# EasyEDA Pro project 2.8_pcb_src.eprj, schematic Schematic2
Board Name: Board2; Create Date: 2025-01-27; Page Name: P1; Project Name: 2.8_pcb_src; Schematic Name: Schematic2; Update Date: 2025-02-17; Company: EasyEDA.com; Page Size: A4; Version: V1.0
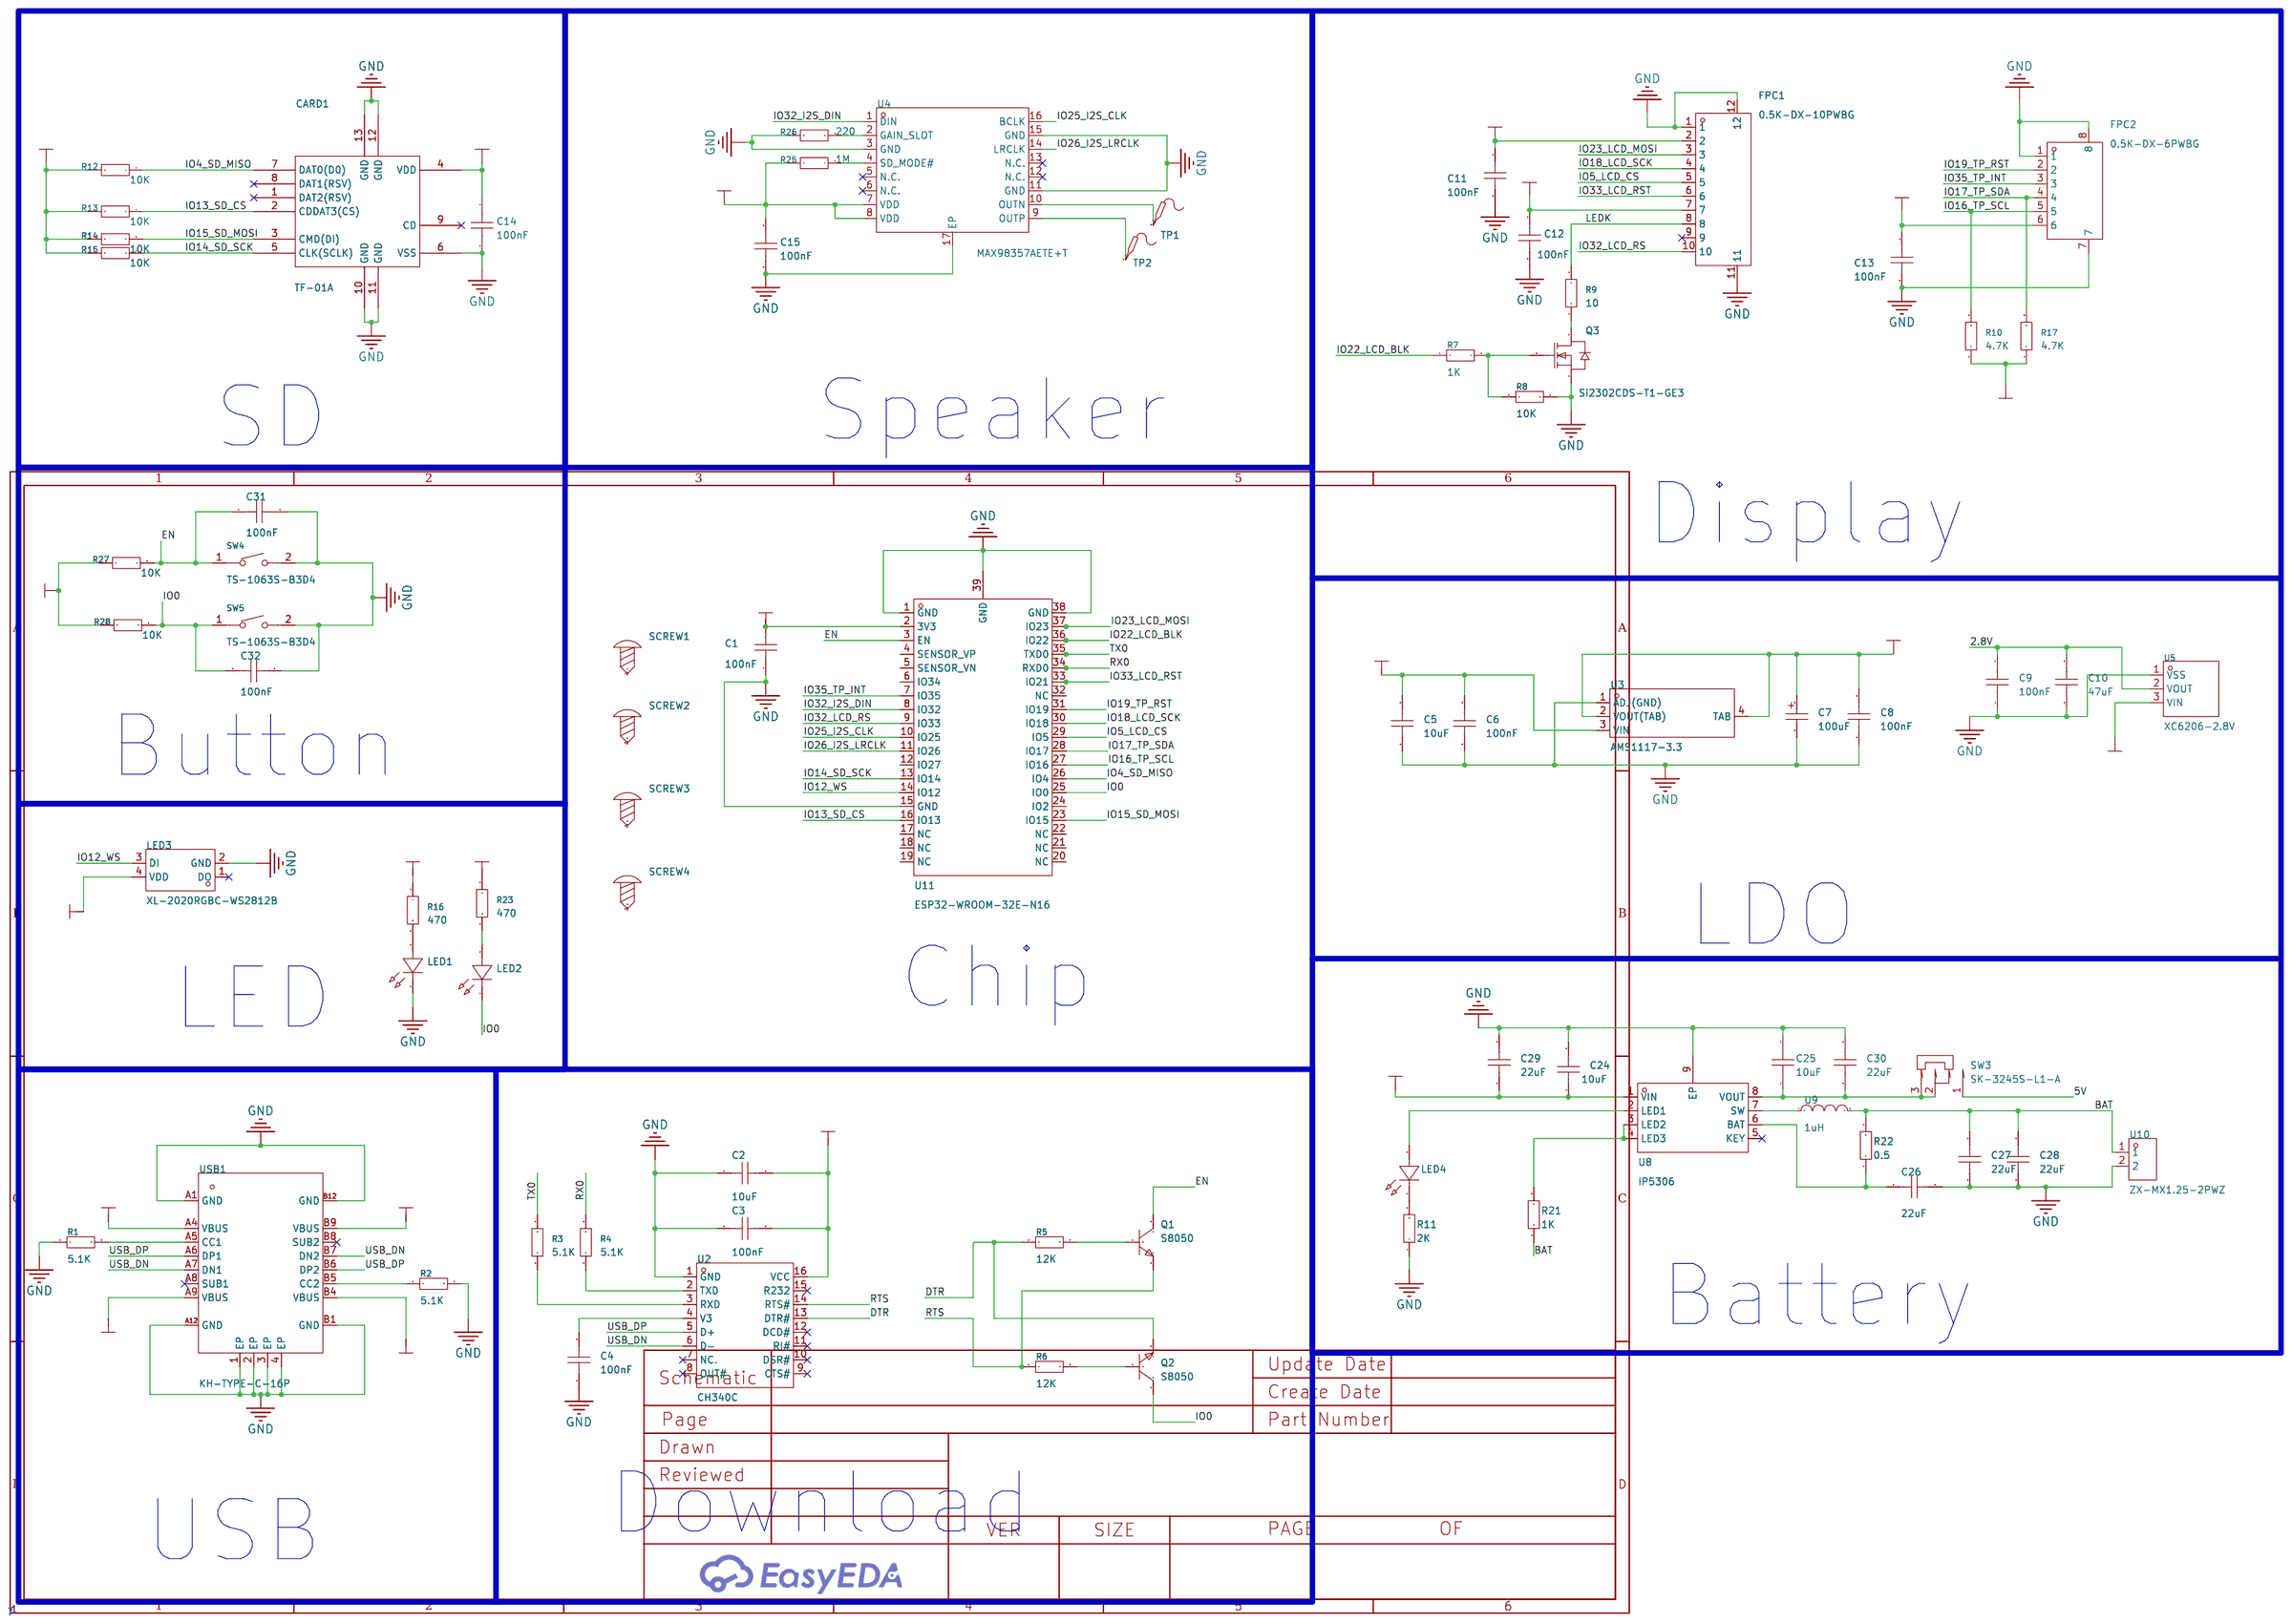
[diagram p1: schematic sheet]

## Parts
C1  100nF  [C0402]
C2  10uF  [C0603]
C3  100nF  [C0402]
C4  100nF  [C0402]
C5  10uF  [C0603]
C6  100nF  [C0402]
C7  100uF  [CASE-B_3528]
C8  100nF  [C0402]
C9  100nF  [C0402]
C10  47uF  [C0603]
C11  100nF  [C0402]
C12  100nF  [C0402]
C13  100nF  [C0402]
C14  100nF  [C0402]
C15  100nF  [C0402]
C24  10uF  [C0603]
C25  10uF  [C0603]
C26  22uF  [C0603]
C27  22uF  [C0603]
C28  22uF  [C0603]
C29  22uF  [C0603]
C30  22uF  [C0603]
C31  100nF  [C0402]
C32  100nF  [C0402]
CARD1  TF-01A  [TF-SMD_TF-01A]
FPC1  0.5K-DX-10PWBG  [FPC-SMD_10P-P0.50_HDGC_0.5K-DX-10PWBG]
FPC2  0.5K-DX-6PWBG  [FPC-SMD_6P-P0.50_DEALON_0.5K-DX-6PWB]
LED1  XL-1608SURC-06  [LED0603-RD_RED]
LED2  XL-1608SURC-06  [LED0603-RD_RED]
LED3  XL-2020RGBC-WS2812B  [LED-SMD_4P-L2.0-W2.0-BR-1]
LED4  XL-1608SURC-06  [LED0603-RD_RED]
Q1  S8050  [SOT-23-3_L2.9-W1.3-P1.90-LS2.3-BR]
Q2  S8050  [SOT-23-3_L2.9-W1.3-P1.90-LS2.3-BR]
Q3  Si2302CDS-T1-GE3  [SOT-23_L2.9-W1.3-P1.90-LS2.4-BR]
R1  5.1K  [R0402]
R2  5.1K  [R0402]
R3  5.1K  [R0402]
R4  5.1K  [R0402]
R5  12K  [R0402]
R6  12K  [R0402]
R7  1K  [R0402]
R8  10K  [R0402]
R9  10  [R0402]
R10  4.7K  [R0402]
R11  2K  [R0402]
R12  10K  [R0402]
R13  10K  [R0402]
R14  10K  [R0402]
R15  10K  [R0402]
R16  470  [R0402]
R17  4.7K  [R0402]
R21  1K  [R0402]
R22  1K  [R0402]
R23  470  [R0402]
R25  1M  [R0402]
R26  220  [R0402]
R27  10K  [R0402]
R28  10K  [R0402]
SCREW1  -  [Screw-Hole-M2]
SCREW2  -  [Screw-Hole-M2]
SCREW3  -  [Screw-Hole-M2]
SCREW4  -  [Screw-Hole-M2]
SW3  SK-3245S-L1-A  [SW-SMD_SK-3245S-L1-A-1]
SW4  TS-1063S-B3D4  [KEY-SMD_L3.0-W2.5-LS4.0_TS-1603S]
SW5  TS-1063S-B3D4  [KEY-SMD_L3.0-W2.5-LS4.0_TS-1603S]
TP1  -  [Test-Point-0.5mm]
TP2  -  [Test-Point-0.5mm]
U2  CH340C  [SOP-16_L10.0-W3.9-P1.27-LS6.0-BL]
U3  AMS1117-3.3  [SOT-223-4_L6.5-W3.5-P2.30-LS7.0-BR]
U4  MAX98357AETE+T  [TQFN-16_L3.0-W3.0-P0.50-BL-EP1.5]
U5  XC6206-2.8V  [SOT-23-3_L2.9-W1.6-P1.90-LS2.8-BR]
U8  IP5306  [ESOP-8_L4.9-W3.9-P1.27-LS6.0-BL-EP]
U9  1uH  [IND-SMD_L2.5-W2.0_YXNAQ252010-3R3M]
U10  ZX-MX1.25-2PWZ  [CONN-TH_2P-P1.25_ZX-MX1.25-2PWZ]
U11  ESP32-WROOM-32E-N16  [WIFI-SMD_ESP32-WROOM-32E]
USB1  KH-TYPE-C-16P  [USB-C-SMD_KH-TYPE-C-16P]

## Library data of the parts
C1 C3 C4 C6 C8 C9 C11-C15 C31 C32 = CL05B104KO5NNNC: LCSC Part Name: 100nF ±10% 16V; Supplier Part: C1525; Manufacturer: SAMSUNG(三星); Supplier Footprint: 0402; JLCPCB Part Class: Basic Part; Datasheet: https://atta.szlcsc.com/upload/public/pdf/source/20160218/1457707763339.pdf; Supplier: LCSC; Tolerance: ±10%
C2 C5 = CGA0603X5R106K100JT: LCSC Part Name: 10uF ±10% 10V; Supplier Part: C6119842; Manufacturer: HRE(芯声); Supplier Footprint: 0603; JLCPCB Part Class: Extended Part; Supplier: LCSC; Tolerance: ±10%
C7 = TAJB107K006RNJ: LCSC Part Name: 100uF ±10% 6.3V; Supplier Part: C16133; Manufacturer: Kyocera AVX; Supplier Footprint: CASE-B-3528-21(mm); JLCPCB Part Class: Basic Part; Datasheet: https://atta.szlcsc.com/upload/public/pdf/source/20160107/1457707750344.pdf; Supplier: LCSC; Tolerance: ±10%; Equivalent Series Resistance(ESR): 1.7Ω@100kHz; Operating Temperature: -55℃~+125℃
C10 = CL10A476MQ8QRNC: LCSC Part Name: 47uF ±20% 6.3V; Supplier Part: C730416; Manufacturer: SAMSUNG(三星); Supplier Footprint: 0603; JLCPCB Part Class: Extended Part; Datasheet: https://atta.szlcsc.com/upload/public/pdf/source/20160218/1457707763339.pdf; Supplier: LCSC; Tolerance: ±20%
C24-C30 = CGA0603X5R106K100JT: 容值:10uF;精度:±10%;额定电压:10V;材质(温度系数):X5R;; LCSC Part Name: 10uF ±10% 10V; Supplier Part: C6119842; Manufacturer: HRE(芯声); Supplier Footprint: 0603; JLCPCB Part Class: 扩展库; Supplier: LCSC; Tolerance: ±10%; Voltage Rated: 10V; Temperature Coefficient: X5R
CARD1 = TF-01A_C91145: LCSC Part Name: 自弹式 MicroSD卡(TF卡) 卡座; Supplier Part: C91145; Manufacturer: 韩国韩荣; Supplier Footprint: SMD; JLCPCB Part Class: Extended Part; Datasheet: https://atta.szlcsc.com/upload/public/pdf/source/20190322/C91145_63CBD6FB4639A3A3EC6A9721F18AE0FB.pdf; Supplier: LCSC; Card Connection Mode: Self-bouncing; Card Type: MicroSD card (TF card); Connector Type: Card Slot; Supplementary Features: With Locating Pin; Maximum Body Height: 1.85mm
FPC1 = 0.5K-DX-10PWBG: LCSC Part Name: 间距:0.5mm P数:10P 翻盖式 下接; Supplier Part: C2911882; Manufacturer: HDGC(华德共创); Supplier Footprint: SMD,P=0.5mm,卧贴; JLCPCB Part Class: Extended Part; Datasheet: https://atta.szlcsc.com/upload/public/pdf/source/20211029/EDC59C5BA257836333CAE013AFC084A6.pdf; Supplier: LCSC; Locking Feature: Flip type; Contact Type: Bottom Contact; Number of Contacts: 10P; Pitch: 0.5mm; Mounting Type: Horizontal attachment; FFC, FCB Thickness: 0.3mm; Height Above Board: 2mm; Operating Temperature Range: -20℃~+85℃
FPC2 = 0.5K-DX-6PWBG: LCSC Part Name: 间距:0.5mm P数:6P 翻盖式 下接; Supplier Part: C2911878; Manufacturer: HDGC(华德共创); Supplier Footprint: SMD,P=0.5mm,卧贴; JLCPCB Part Class: Extended Part; Datasheet: https://atta.szlcsc.com/upload/public/pdf/source/20211029/EDC59C5BA257836333CAE013AFC084A6.pdf; Supplier: LCSC; Locking Feature: Flip type; Contact Type: Bottom Contact; Number of Contacts: 6P; Pitch: 0.5mm; Mounting Type: Horizontal attachment; FFC, FCB Thickness: 0.3mm; Height Above Board: 2mm; Operating Temperature Range: -20℃~+85℃
LED1 LED2 = XL-1608SURC-06: Supplier Part: C965799; Manufacturer: XINGLIGHT(成兴光); Supplier Footprint: 0603; JLCPCB Part Class: Extended Part; Datasheet: https://atta.szlcsc.com/upload/public/pdf/source/20221102/D860AFDD1CDB02C5A8064103A32707E2.pdf; Supplier: LCSC; Emitted Color: Red; Power Dissipation: 55mW; Forward Current: 25mA; Dominant Wavelength: 617nm~621nm; Peak Wavelength: 623nm; Lens Color: 无色透明透镜; Viewing Angle: 120°; Mounting Sytle: Positive post; Operating Temperature: -30℃~+85℃
LED3 = XL-2020RGBC-WS2812B: LCSC Part Name: 幻彩透明; Supplier Part: C5349955; Manufacturer: XINGLIGHT(成兴光); Supplier Footprint: 2020; JLCPCB Part Class: Extended Part; Datasheet: https://atta.szlcsc.com/upload/public/pdf/source/20230111/97A2D5930F183799801175706AF118AF.pdf; Supplier: LCSC; Wavelength: 620nm~625nm；470nm~475nm；525nm~530nm; Luminous Intensity: 150mcd；150mcd；400mcd; Lens Color: Translucent Fog Lens; Installation method: Positive Stick; Operating Temperature: -20℃~+85℃
LED4 = XL-1608SURC-06: 发光颜色:红色;功率:55mW;正向电流:25mA;主波长:617nm~621nm;透镜颜色:无色透明透镜;色温:-;发光角度:120°;载带方式:正贴;工作温度:-30℃~+85℃;; Supplier Part: C965799; Manufacturer: XINGLIGHT(成兴光); Supplier Footprint: 0603; JLCPCB Part Class: 扩展库; Datasheet: https://atta.szlcsc.com/upload/public/pdf/source/20221102/D860AFDD1CDB02C5A8064103A32707E2.pdf; Supplier: LCSC; Emitted Color: 红色; Power Dissipation: 55mW; Forward Current: 25mA; Dominant Wavelength: 617nm~621nm; Peak Wavelength: 623nm; Lens Color: 无色透明透镜; Viewing Angle: 120°; Mounting Sytle: 正贴; Operating Temperature: -30℃~+85℃
Q1 Q2 = S8050_C20069125: LCSC Part Name: hFE:200-350，丝印:J3Y; Supplier Part: C20069125; Manufacturer: 宏迦橙; Supplier Footprint: SOT-23; JLCPCB Part Class: Extended Part; Datasheet: https://atta.szlcsc.com/upload/public/pdf/source/20240403/2D78449C96B6E27F13BF8BDF79E27159.pdf; Supplier: LCSC; DC Current Gain (hFE@Ic,Vce): 120@50mA,1.0V; Transition Frequency (fT): 100MHz; Collector Cut-Off Current (Icbo): 100nA; Collector-Emitter Saturation Voltage (VCE(sat)@Ic,Ib): 600mV@500mA,50mA; Operating Temperature: -55℃~+150℃
Q3 = Si2302CDS-T1-GE3: LCSC Part Name: 1个N沟道 耐压:20V 电流:2.9A; Supplier Part: C10488; Manufacturer: VISHAY(威世); Supplier Footprint: SOT-23; JLCPCB Part Class: Extended Part; Datasheet: https://atta.szlcsc.com/upload/public/pdf/source/20121215/1457706570095.pdf; Supplier: LCSC; Type: 1 N-Channel; Drain Source On Resistance (RDS(on)@Vgs,Id): 0.057Ω@4.5V,3.6A; Power Dissipation (Pd): 550mW; Gate Threshold Voltage (Vgs(th)@Id): 850mV@250uA; Total Gate Charge (Qg@Vgs): 3.5nC@4.5V; Input Capacitance (Ciss@Vds): 320pF@10V; Reverse Transfer Capacitance (Crss@Vds): 5pF@10V; Operating Temperature: -55℃~+150℃
R1-R10 R12-R17 R23 R25-R28 = 0402WGF4700TCE: LCSC Part Name: 470Ω ±1% 62.5mW 厚膜电阻; Supplier Part: C25117; Manufacturer: UNI-ROYAL(厚声); Supplier Footprint: 0402; JLCPCB Part Class: Basic Part; Datasheet: https://atta.szlcsc.com/upload/public/pdf/source/20200306/C422600_1E6D84923E4A46A82E41ADD87F860B5C.pdf; Supplier: LCSC; Type: Thick Film Resistors; Tolerance: ±1%; Temperature Coefficient: ±100ppm/℃; Operating Temperature Range: -55℃~+155℃
R11 R21 R22 = 0402WGF4700TCE: 电阻类型:厚膜电阻;阻值:470Ω;精度:±1%;功率:62.5mW;最大工作电压:50V;温度系数:±100ppm/℃;; LCSC Part Name: 470Ω ±1% 62.5mW 厚膜电阻; Supplier Part: C25117; Manufacturer: UNI-ROYAL(厚声); Supplier Footprint: 0402; JLCPCB Part Class: 基础库; Datasheet: https://atta.szlcsc.com/upload/public/pdf/source/20200306/C422600_1E6D84923E4A46A82E41ADD87F860B5C.pdf; Supplier: LCSC; Type: 厚膜电阻; Tolerance: ±1%; Power(Watts): 62.5mW; Overload Voltage (Max): 50V; Temperature Coefficient: ±100ppm/℃; Operating Temperature Range: -55℃~+155℃
SCREW1-SCREW4 = Screw-Hole-M2: Supplier Footprint: 插件
SW3 = SK-3245S-L1-A: Circuit:DPDT Actuator Style:Rectangular columnar Pin Style:SMDSplicing Switch Length:9.1mm Switch Width:3.55mm Switch Height:3.2mm Mounting Style:卧贴 Actuator Color:Black Current Rating (DC):50mA Voltage Rating (DC):12V Current Rating (AC):50mA Voltage Rat; LCSC Part Name: 柄长2mm 卧贴双档 滑动开关; Supplier Part: C405951; Manufacturer: XKB Connection(中国星坤); Supplier Footprint: SMD; JLCPCB Part Class: Extended Part; Datasheet: https://atta.szlcsc.com/upload/public/pdf/source/20200227/C405951_CBAB505F81ACCB08512C6DA919ADD92C.pdf; Supplier: LCSC; Circuit: DPDT; Actuator Style: Rectangular columnar; Pin Style: SMDSplicing; Switch Length: 9.1mm; Switch Width: 3.55mm; Switch Height: 3.2mm; Mounting Style: 卧贴; Actuator Color: Black; Current Rating (DC): 50mA; Voltage Rating (DC): 12V; Current Rating (AC): 50mA; Voltage Rating (AC): 12V; Mechanical Life: 1万次; Operating Temperature: -40℃~+85℃
SW4 SW5 = TS-1063S-B3D4: LCSC Part Name: 轻触开关3.0*2.5侧按贴片带柱小小龟250gf; Supplier Part: C498291; Manufacturer: Yuandi(元迪); JLCPCB Part Class: Extended Part; Datasheet: https://atta.szlcsc.com/upload/public/pdf/source/20200318/C498291_A3607BD92317BA61A63F6AFAF35A0DD0.pdf; Supplier: LCSC; Circuit: SPST; Actuator Style: Rectangle button; Operating Force: 250gf
TP1 TP2 = Test-Point
U2 = CH340C: LCSC Part Name: CH340C USB转串口芯片 CH340; Supplier Part: C84681; Manufacturer: WCH(南京沁恒); Supplier Footprint: SOP-16; JLCPCB Part Class: Extended Part; Datasheet: https://atta.szlcsc.com/upload/public/pdf/source/20240619/63986D8440D4E5267A77ACD891CC4DE3.pdf; Supplier: LCSC; Applications Function: Transceiver; Supply Voltage: 3.3V；5V; Data Rate: 2Mbps
U3 = AMS1117-3.3_C347222: LCSC Part Name: 输出:3.3V 电流:1A 耐压:12V; Supplier Part: C347222; Manufacturer: UMW(友台半导体); Supplier Footprint: SOT-223; Datasheet: https://atta.szlcsc.com/upload/public/pdf/source/20241218/BAF0263FA2E44BCD8AF41AA4FA04EFAA.pdf; Supplier: LCSC; Output Type: Fixed; Maximum Input Voltage: 12V; Output Voltage: 3.3V; Output Current: 1A; Power Supply Rejection Ratio (PSRR): 60dB@(120Hz); Dropout Voltage: 1.3V@(1A); Feature: Overcurrent Protection(OCP); Output Polarity: Positive electrode; Number of Outputs: 1
U4 = MAX98357AETE+T: LCSC Part Name: 微型、低成本、PCM 类 D 级放大器具有 AB 级性能; Supplier Part: C910544; Manufacturer: ADI(亚德诺)/MAXIM(美信); Supplier Footprint: TQFN-16-EP(3x3); JLCPCB Part Class: Extended Part; Datasheet: https://atta.szlcsc.com/upload/public/pdf/source/20210106/C910544_CB6DE4B2CEE254A72E6BDB40E718D281.pdf; Supplier: LCSC; Speaker Channels: Monaural; Supply Voltage: 2.5V~5.5V; Operating Temperature: -40℃~+85℃
U5 = XC6206-2.8V: LCSC Part Name: 输入6V 输出2.8V 250mA; Supplier Part: C2892669; Manufacturer: YONGYUTAI(永裕泰); Supplier Footprint: SOT-23-3L; JLCPCB Part Class: Extended Part; Datasheet: https://atta.szlcsc.com/upload/public/pdf/source/20210901/DE3C77F0CE73FFE8F7C655BE9B94CB06.pdf; Supplier: LCSC; Maximum Input Voltage: 6V; Output Voltage: 2.8V; MAX Output Current: 250mA; Operating Temperature: -40℃~+85℃@(Tj); Output Polarity: Positive electrode; Number of Outputs: 1
U8 = IP5306: Supplier Part: C181692; Manufacturer: INJOINIC(英集芯); Supplier Footprint: ESOP-8; JLCPCB Part Class: Extended Part; Datasheet: https://atta.szlcsc.com/upload/public/pdf/source/20190627/C384572_9925B3DDC4041BC6108E5AB46A2A0AB1.pdf; Supplier: LCSC
U9 = IND\L2.5XW: Supplier Part: C9900016568; Supplier Footprint: 2.2uH/60; JLCPCB Part Class: Extended Part; Supplier: LCSC
U10 = ZX-MX1.25-2PWZ: LCSC Part Name: 1x2P 间距:1.25mm 弯插 系列:PicoBlade(MX 1.25) 配套胶壳型号：ZX-MX1.25-2PJK 配套端子型号：ZX-MX1.25-DZ 配套杜邦线型号：ZX-MX1.25-2PBXC; Supplier Part: C7430463; Manufacturer: Megastar(兆星); Supplier Footprint: 弯插,P=1.25mm; JLCPCB Part Class: Extended Part; Datasheet: https://atta.szlcsc.com/upload/public/pdf/source/20230619/EFC7482EB916E36F9EF0B03A9637C24F.pdf; Supplier: LCSC; Pins Structure: 1x2P; Pitch: 1.25mm; Mounting Style: Bend-in; Reference Series: PicoBlade(MX 1.25); Number of Pins: 2P; Number of Rows: 1; Number of PINs Per Row: 2; Contact Material: Brass; Contact Plating: Tin; Colour: White; Z-Height of the Board: 3.3mm; X-Length of Bottom Edge on Board (Spacing Line): 4.4mm; Y-Width of Bottom Edge on Board: 4.6mm
U11 = ESP32-WROOM-32E-N16_C701343: LCSC Part Name: 通用型Wi-Fi+BT+BLE MCU模组; Supplier Part: C701343; Manufacturer: ESPRESSIF(乐鑫); Supplier Footprint: SMD,18x25.5mm; JLCPCB Part Class: Extended Part; Datasheet: https://atta.szlcsc.com/upload/public/pdf/source/20241030/447B1C85FFE3FB0A37F75624F2C6635F.pdf; Supplier: LCSC
USB1 = KH-TYPE-C-16P: LCSC Part Name: Type-C 母 卧贴; Supplier Part: C709357; Manufacturer: kinghelm(金航标); Supplier Footprint: SMD; JLCPCB Part Class: Extended Part; Datasheet: https://atta.szlcsc.com/upload/public/pdf/source/20200911/C709357_AA8DCEB38BB20E3035A7ED7AE7667837.pdf; Supplier: LCSC; Connector Type: Type-C; Gender: Female; Number of Ports: 1; Number of Contacts: 16P; Mounting Style: 卧贴; Current Rating - Power (Max): 3A; Operating Temperature Range: -40℃~+85℃

## Nets
2.8V: C9.2 C10.2 C11.1 FPC1.2 U5.2(VOUT)
3V3: C1.2 C7.1 C8.2 C12.1 C13.1 C14.1 C15.1 CARD1.4(VDD) FPC1.7 FPC2.6 R10.1 R12.2 R13.2 R14.2 R15.2 R16.1 R17.1 R23.1 R25.2 R27.2 R28.2 U3.2(VOUT(TAB)) U3.4(TAB) U4.7(VDD) U4.8(VDD) U5.3(VIN) U11.2(3V3)
5V: C2.2 C3.1 C5.2 C6.1 LED3.4(VDD) SW3.1 U2.16(VCC) U3.3(VIN)
GND: C1.1 C2.1 C3.2 C4.1 C5.1 C6.2 C7.2 C8.1 C9.1 C10.1 C11.2 C12.2 C13.2 C14.2 C15.2 C24.2 C25.2 C26.1 C27.2 C28.2 C29.1 C30.1 C31.1 C32.1 CARD1.6(VSS) CARD1.10(GND) CARD1.11(GND) CARD1.12(GND) CARD1.13(GND) FPC1.1 FPC1.11 FPC1.12 FPC2.1 FPC2.7 FPC2.8 LED1.1(K) LED3.2(GND) Q3.2(S) R1.1 R2.2 R8.2 R11.1 R26.2 SW4.2 SW5.2 U2.1(GND) U3.1(ADJ(GND)) U4.3(GND) U4.11(GND) U4.15(GND) U4.17(EP) U5.1(VSS) U8.9(EP) U10.2 U11.1(GND) U11.15(GND) U11.38(GND) U11.39(GND) USB1.1(EP) USB1.2(EP) USB1.3(EP) USB1.4(EP) USB1.A1(GND) USB1.A12(GND) USB1.B1(GND) USB1.B12(GND)
BAT: C27.1 C28.1 R21.1 R22.2 U9.2 U10.1
DTR: Q2.2(E) R5.1 U2.13(DTR#)
EN: C31.2 Q1.3(C) R27.1 SW4.1 U11.3(EN)
IO0: C32.2 LED2.1(K) Q2.3(C) R28.1 SW5.1 U11.25(IO0)
IO4_SD_MISO: CARD1.7(DAT0(D0)) R12.1 U11.26(IO4)
IO5_LCD_CS: FPC1.5 U11.29(IO5)
IO12_WS: LED3.3(DI) U11.14(IO12)
IO13_SD_CS: CARD1.2(CDDAT3(CS)) R13.1 U11.16(IO13)
IO14_SD_SCK: CARD1.5(CLK(SCLK)) R15.1 U11.13(IO14)
IO15_SD_MOSI: CARD1.3(CMD(DI)) R14.1 U11.23(IO15)
IO16_TP_SCL: FPC2.5 R10.2 U11.27(IO16)
IO17_TP_SDA: FPC2.4 R17.2 U11.28(IO17)
IO18_LCD_SCK: FPC1.4 U11.30(IO18)
IO19_TP_RST: FPC2.2 U11.31(IO19)
IO22_LCD_BLK: R7.1 U11.36(IO22)
IO23_LCD_MOSI: FPC1.3 U11.37(IO23)
IO25_I2S_CLK: U4.16(BCLK) U11.10(IO25)
IO26_I2S_LRCLK: U4.14(LRCLK) U11.11(IO26)
IO32_I2S_DIN: U4.1(DIN) U11.8(IO32)
IO32_LCD_RS: FPC1.10 U11.9(IO33)
IO33_LCD_RST: FPC1.6 U11.33(IO21)
IO35_TP_INT: FPC2.3 U11.7(IO35)
LEDK: FPC1.8 R9.2
RTS: Q1.2(E) R6.1 U2.14(RTS#)
RX0: R4.2 U11.34(RXD0)
TX0: R3.2 U11.35(TXD0)
USB_5V: C24.1 C29.2 U8.1(VIN) USB1.A4(VBUS) USB1.A9(VBUS) USB1.B4(VBUS) USB1.B9(VBUS)
USB_DN: U2.6(D-) USB1.A7(DN1) USB1.B7(DN2)
USB_DP: U2.5(D+) USB1.A6(DP1) USB1.B6(DP2)
$1N3732: R21.2 U8.3(LED2) U8.4(LED3)
$1N3735: C25.1 C30.2 SW3.2 SW3.3 U8.8(VOUT)
$1N3738: U8.7(SW) U9.1
$1N3741: C26.2 R22.1 U8.6(BAT)
$1N3751: R1.2 USB1.A5(CC1)
$1N3752: R2.1 USB1.B5(CC2)
$1N3763: R4.1 U2.2(TXD)
$1N3764: R3.1 U2.3(RXD)
$1N3773: C4.2 U2.4(V3)
$1N3785: Q1.1(B) R5.2
$1N3786: Q2.1(B) R6.2
$1N3820: Q3.1(G) R7.2 R8.1
$1N3822: Q3.3(D) R9.1
$1N3854: TP1.1 U4.10(OUTN)
$1N3855: TP2.1 U4.9(OUTP)
$1N3915: R25.1 U4.4(SD_MODE#)
$1N3916: R26.1 U4.2(GAIN_SLOT)
Net-(LED1-2): LED1.2(A) R16.2
Net-(LED2-2): LED2.2(A) R23.2
Net-(LED4-1): LED4.1(K) R11.2
Net-(LED4-2): LED4.2(A) U8.2(LED1)

Not connected (* = marked no-connect by the designer): CARD1 1(DAT2(RSV))* 8(DAT1(RSV))* 9(CD)*; FPC1 9*; LED3 1(DO)*; SCREW1 1; SCREW2 1; SCREW3 1; SCREW4 1; U2 7(NC.)* 8(OUT#)* 9(CTS#)* 10(DSR#)* 11(RI#)* 12(DCD#)* 15(R232)*; U4 5(N.C.)* 6(N.C.)* 12(N.C.)* 13(N.C.)*; U8 5(KEY)*; U11 4(SENSOR_VP) 5(SENSOR_VN) 6(IO34) 12(IO27) 17(NC) 18(NC) 19(NC) 20(NC) 21(NC) 22(NC) 24(IO2) 32(NC); USB1 A8(SUB1)* B8(SUB2)*

## Notes on the sheet
- SD
- Speaker
- Display
- Button
- LDO
- Chip
- LED
- Battery
- Download
- USB
